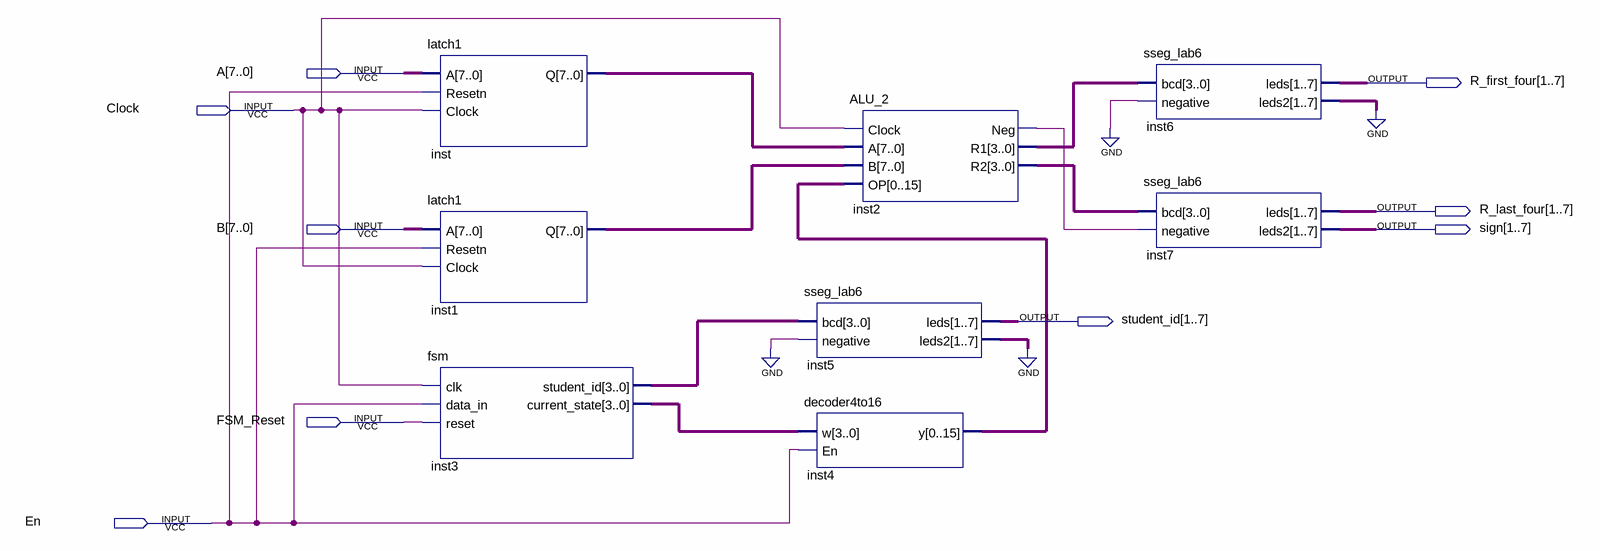
[diagram p0: schematic sheet]
// Quartus schematic lab6_problemset2.bdf as structural Verilog: 8 symbols, 9 pins
module lab6_problemset2 (
  input  [7:0] A,
  input  Clock,
  input  [7:0] B,
  input  FSM_Reset,
  input  En,
  output [1:7] R_first_four,
  output [1:7] R_last_four,
  output [1:7] sign,
  output [1:7] student_id
);

  wire inst2_neg;
  wire [3:0] inst2_r1, inst2_r2, inst3_current_state, inst3_student_id;
  wire [6:0] inst5_leds2, inst6_leds2;
  wire [7:0] inst1_q, inst_q;
  wire [15:0] inst4_y;

  latch1 inst (.A(A), .Resetn(En), .Clock(Clock), .Q(inst_q));
  latch1 inst1 (.A(B), .Resetn(En), .Clock(Clock), .Q(inst1_q));
  fsm inst3 (
    .clk(Clock), .data_in(En), .reset(FSM_Reset), .student_id(inst3_student_id),
    .current_state(inst3_current_state));
  sseg_lab6 inst5 (.bcd(inst3_student_id), .negative(1'b0), .leds(student_id), .leds2(inst5_leds2));
  decoder4to16 inst4 (.w(inst3_current_state), .En(En), .y(inst4_y));
  ALU_2 inst2 (.Clock(Clock), .A(inst_q), .B(inst1_q), .OP(inst4_y), .Neg(inst2_neg), .R1(inst2_r1), .R2(inst2_r2));
  sseg_lab6 inst6 (.bcd(inst2_r1), .negative(1'b0), .leds(R_first_four), .leds2(inst6_leds2));
  sseg_lab6 inst7 (.bcd(inst2_r2), .negative(inst2_neg), .leds(R_last_four), .leds2(sign));
  // also tied to GND on the sheet: {inst5_leds2[0], inst5_leds2[1], inst5_leds2[2], inst5_leds2[3], inst5_leds2[4], inst5_leds2[5], inst5_leds2[6], inst6_leds2[0], inst6_leds2[1], inst6_leds2[2], inst6_leds2[3], inst6_leds2[4], inst6_leds2[5], inst6_leds2[6]}
endmodule
